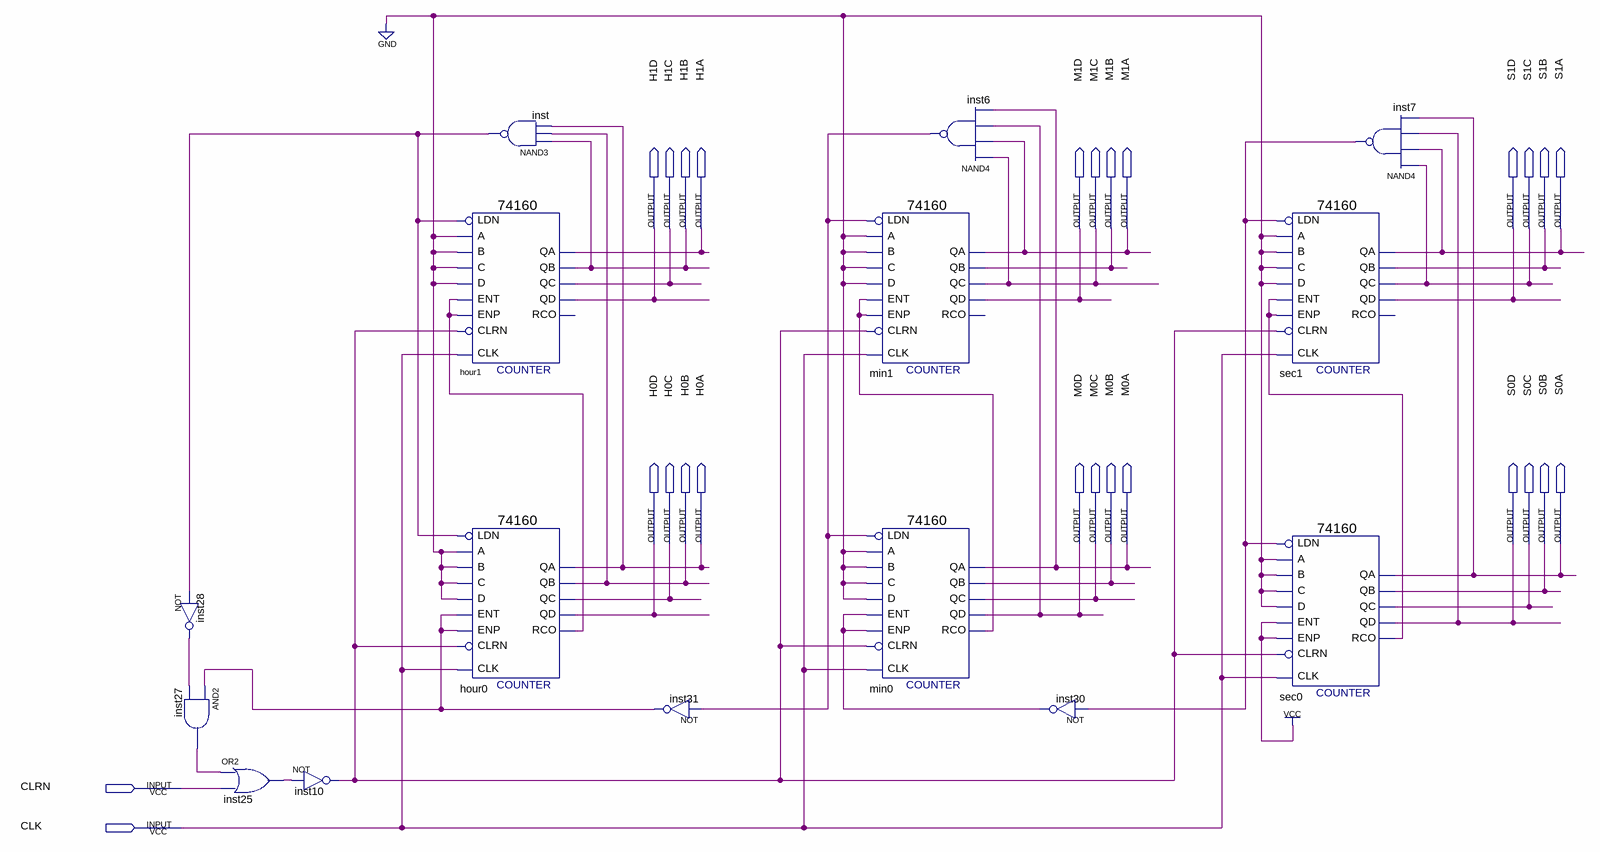
[diagram p0: schematic sheet]
// Quartus schematic CLOCK.bdf as structural Verilog: 15 symbols, 26 pins
module CLOCK (
  input  CLRN,
  input  CLK,
  output H1D,
  output H1C,
  output H1B,
  output H1A,
  output M1D,
  output M1C,
  output M1B,
  output M1A,
  output S1D,
  output S1C,
  output S1B,
  output S1A,
  output H0D,
  output H0C,
  output H0B,
  output H0A,
  output M0D,
  output M0C,
  output M0B,
  output M0A,
  output S0D,
  output S0C,
  output S0B,
  output S0A
);

  wire hour0_rco, inst6_out, inst7_out, inst10_out, inst25_out, inst27_out, inst28_out, inst30_out,
       inst31_out, inst_out, min0_rco, sec0_rco;

  not inst28 (inst28_out, inst_out);
  and inst27 (inst27_out, inst31_out, inst28_out);
  or inst25 (inst25_out, inst27_out, CLRN);
  not inst10 (inst10_out, inst25_out);
  \74160  hour1 (
    .CLK(CLK), .ENT(hour0_rco), .A(1'b0), .B(1'b0), .C(1'b0), .D(1'b0), .LDN(inst_out), .ENP(hour0_rco),
    .CLRN(inst10_out), .QD(H1D), .QA(H1A), .QB(H1B), .QC(H1C));  // open: RCO
  \74160  hour0 (
    .CLK(CLK), .ENT(inst31_out), .A(1'b0), .B(1'b0), .C(1'b0), .D(1'b0), .LDN(inst_out), .ENP(inst31_out),
    .CLRN(inst10_out), .QD(H0D), .QA(H0A), .QB(H0B), .QC(H0C), .RCO(hour0_rco));
  nand inst (inst_out, H1B, H0B, H0A);
  not inst31 (inst31_out, inst6_out);
  \74160  min1 (
    .CLK(CLK), .ENT(min0_rco), .A(1'b0), .B(1'b0), .C(1'b0), .D(1'b0), .LDN(inst6_out), .ENP(min0_rco),
    .CLRN(inst10_out), .QD(M1D), .QA(M1A), .QB(M1B), .QC(M1C));  // open: RCO
  \74160  min0 (
    .CLK(CLK), .ENT(inst30_out), .A(1'b0), .B(1'b0), .C(1'b0), .D(1'b0), .LDN(inst6_out), .ENP(inst30_out),
    .CLRN(inst10_out), .QD(M0D), .QA(M0A), .QB(M0B), .QC(M0C), .RCO(min0_rco));
  nand inst6 (inst6_out, M1C, M1A, M0D, M0A);
  not inst30 (inst30_out, inst7_out);
  \74160  sec1 (
    .CLK(CLK), .ENT(sec0_rco), .A(1'b0), .B(1'b0), .C(1'b0), .D(1'b0), .LDN(inst7_out), .ENP(sec0_rco),
    .CLRN(inst10_out), .QD(S1D), .QA(S1A), .QB(S1B), .QC(S1C));  // open: RCO
  \74160  sec0 (
    .CLK(CLK), .ENT(1'b1), .A(1'b0), .B(1'b0), .C(1'b0), .D(1'b0), .LDN(inst7_out), .ENP(1'b1),
    .CLRN(inst10_out), .QD(S0D), .QA(S0A), .QB(S0B), .QC(S0C), .RCO(sec0_rco));
  nand inst7 (inst7_out, S1C, S1A, S0D, S0A);
endmodule
